# EAGLE design ADC128S022 and ADM823 Breakout Board (EAGLE 9.6.2)
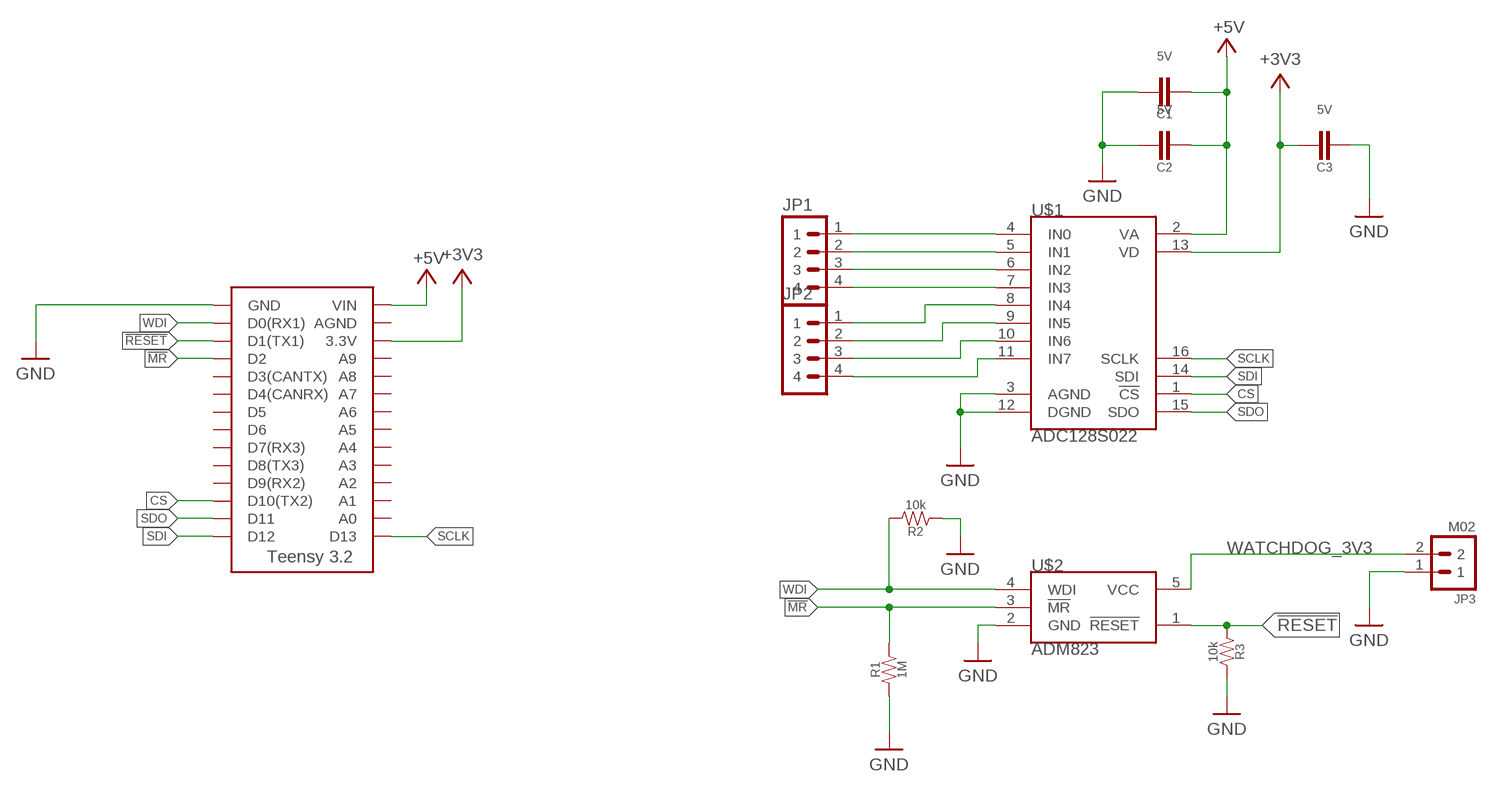
[diagram p0: schematic, sheet 1]

## Parts
C1  1uF  CAP0603-CAP  [0603-CAP]
C2  0.1uF  CAP0603-CAP  [0603-CAP]
C3  0.1uF  CAP0603-CAP  [0603-CAP]
JP1  M04  [1X04]
JP2  M04  [1X04]
JP3  M02  [1X02]
R1  1M  RESISTOR0603  [0603-RES]
R2  10k  RESISTOR0603  [0603-RES]
R3  10k  RESISTOR0603  [0603-RES]
U$1  ADC128S022  [TSSOP-16]
U$2  ADM823  [SOT323-5]
U$3  TEENSY_3.2_SIMPLE  [TEENSY_3.2_SIMPLE]

## Nets
!MR!: R1.2 U$2.3(!MR!) U$3.D2
!RESET!: R3.1 U$2.1(!RESET!) U$3.D1(TX1)
+3V3: C3.1 U$1.13(VD) U$3.3.3V
+5V: C1.2 C2.2 U$1.2(VA) U$3.VIN
CS: U$1.1(!CS!) U$3.D10(TX2)
GND: C1.1 C2.1 C3.2 JP3.1 R1.1 R2.1 R3.2 U$1.3(AGND) U$1.12(DGND) U$2.2(GND) U$3.GND
N$1: JP1.1 U$1.4(IN0)
N$2: JP1.2 U$1.5(IN1)
N$3: JP1.3 U$1.6(IN2)
N$4: JP1.4 U$1.7(IN3)
N$5: JP2.1 U$1.8(IN4)
N$6: JP2.2 U$1.9(IN5)
N$7: JP2.3 U$1.10(IN6)
N$8: JP2.4 U$1.11(IN7)
SCLK: U$1.16(SCLK) U$3.D13
SDI: U$1.14(SDI) U$3.D12
SDO: U$1.15(SDO) U$3.D11
WATCHDOG_3V3: JP3.2 U$2.5(VCC)
WDI: R2.2 U$2.4(WDI) U$3.D0(RX1)
Unconnected: U$3.A0 U$3.A1 U$3.A2 U$3.A3 U$3.A4 U$3.A5 U$3.A6 U$3.A7 U$3.A8 U$3.A9 U$3.AGND U$3.D3(CANTX) U$3.D4(CANRX) U$3.D5 U$3.D6 U$3.D7(RX3) U$3.D8(TX3) U$3.D9(RX2)

## Library data of the parts
C1-C3 = HyTechDevices:CAP: Capacitor Standard 0603 ceramic capacitor, and 0.1" leaded capacitor.; VALUE: 4; VOLTAGE: 5V
JP1 JP2 = HyTechDevices:M04: Standard 4-pin 0.1" header. NOTES ON THE VARIANTS LOCK and LOCK_LONGPADS... This footprint was designed to help hold the alignment of a through-hole component (i.e. 6-pin header) while soldering it into place. You may notice that each hole has been shifted either up or down by 0.005 of an inch from it's more standard position (which is a perfectly straight line). This slight alteration caused the pins (the squares in the middle) to touch the edges of the holes. Because they are alternating, it causes a "brace" to hold the component in place. 0.005 has proven to be the perfect amount of "off-center" position when using our standard breakaway headers. Although looks a little odd when you look at the bare footprint, once you have a header in there, the alteration is very hard to notice. Also,if you push a header all the way into place, it is covered up entirely on the bottom side. This idea of altering the position of holes to aid alignment will be further integrated into the Sparkfun Library for other footprints. It can help hold any component with 3 or more connection pins. Note: The Sparkfun version includes many other packages including surface mount that may be of future interest. Source: Sparkfun <https://github.com/sparkfun/SparkFun-Eagle-Libraries>
JP3 = HyTechDevices:M02: Standard 2-pin 0.1" header. NOTES ON THE VARIANTS LOCK and LOCK_LONGPADS... This footprint was designed to help hold the alignment of a through-hole component (i.e. 6-pin header) while soldering it into place. You may notice that each hole has been shifted either up or down by 0.005 of an inch from it's more standard position (which is a perfectly straight line). This slight alteration caused the pins (the squares in the middle) to touch the edges of the holes. Because they are alternating, it causes a "brace" to hold the component in place. 0.005 has proven to be the perfect amount of "off-center" position when using our standard breakaway headers. Although looks a little odd when you look at the bare footprint, once you have a header in there, the alteration is very hard to notice. Also,if you push a header all the way into place, it is covered up entirely on the bottom side. This idea of altering the position of holes to aid alignment will be further integrated into the Sparkfun Library for other footprints. It can help hold any component with 3 or more connection pins. Note: The Sparkfun version includes many other packages including surface mount that may be of future interest. Source: Sparkfun <https://github.com/sparkfun/SparkFun-Eagle-Libraries>
R1-R3 = HyTechDevices:RESISTOR: Resistor Basic schematic elements and footprints for 0603, 1206, and PTH resistors.
U$1 = HyTechDevices:ADC128S022: ADC128S022 8-channel Analog to Digital Converter Datasheet <https://www.ti.com/lit/ds/symlink/adc128s022.pdf?ts=1609290895378&ref_url=https%253A%252F%252Fwww.ti.com%252Fproduct%252FADC128S022%253Fqgpn%253Dadc128s022>
U$2 = HyTechDevices:ADM823: ADM823 Watchdog Timer Datasheet <https://www.analog.com/media/en/technical-documentation/data-sheets/ADM823_824_825.pdf>
U$3 = HyTechDevices:TEENSY_3.2_SIMPLE: Simple version of the Teensy 3.2 board that only uses the 2 main rows of pins, not the inner pins or the pins opposite the usb port.

## Board
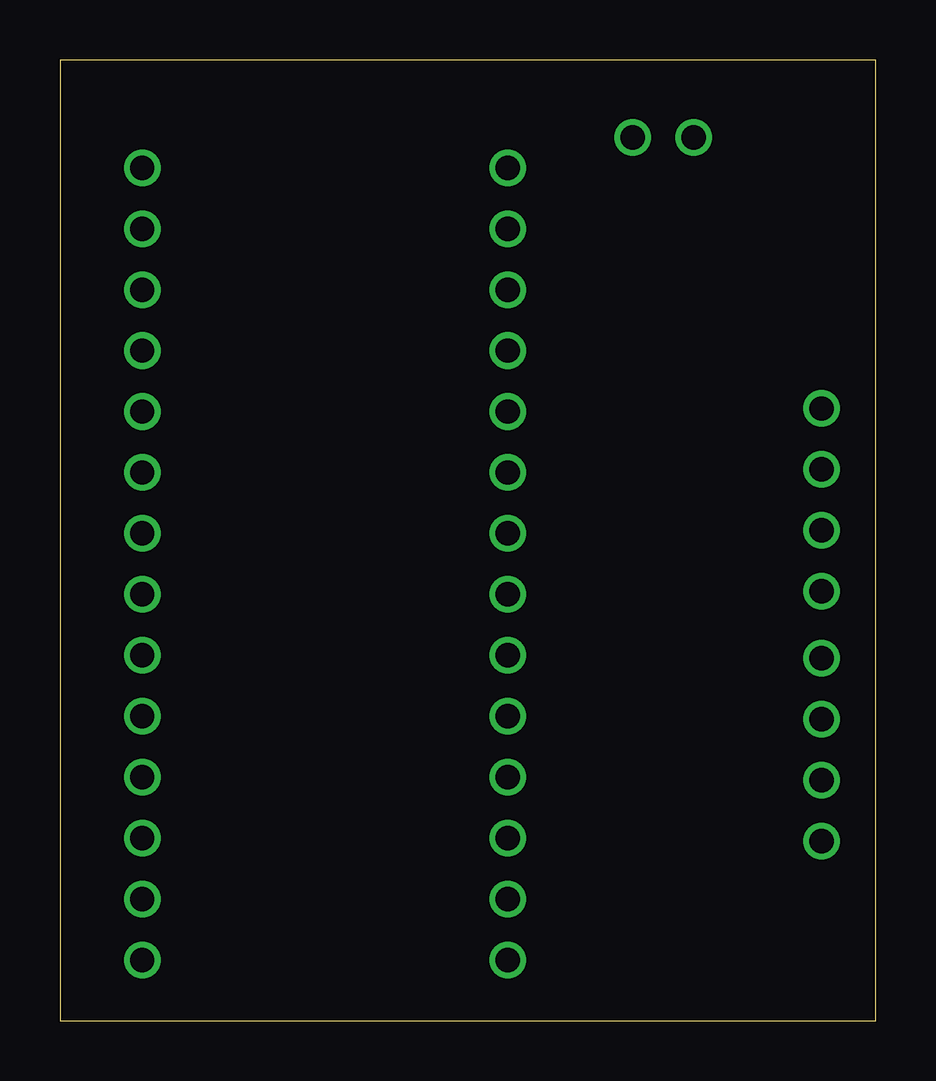
[diagram p1: board, top side]
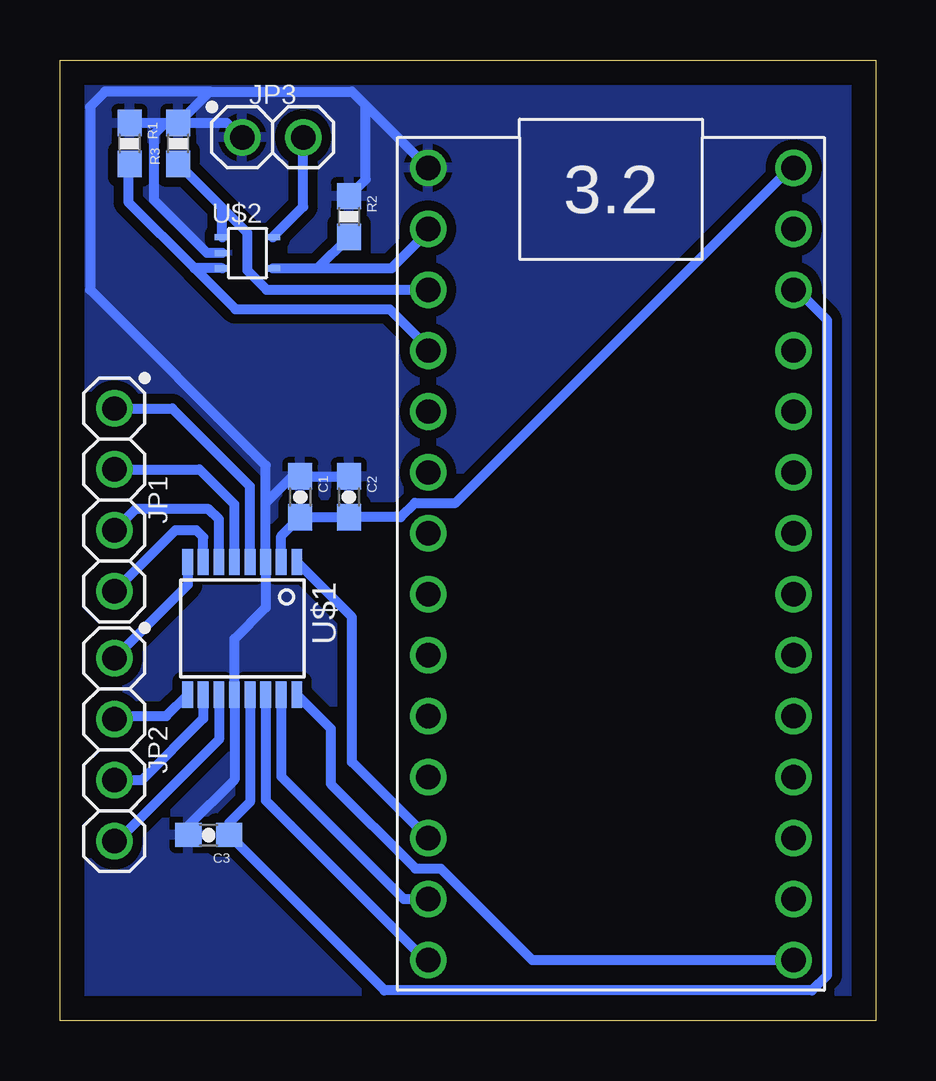
[diagram p2: board, bottom side, seen from below]

Size 34.02 x 40.06 mm. Coordinates in mm from the lower left corner, seen from the top.
Outline: 0,0 34.02,0 34.02,40.06 0,40.06 0,0
Copper layers 16: Bottom 0.035mm
Design rules "On Campus (1 Layer)": minimum track width 16mil, minimum drill 0.8mm, track to track 16mil, track to pad 12mil, pad to pad 16mil, via to via 16mil, smd to smd 10mil, copper to edge 40mil, drill to drill 10mil, minimum pad ring 10mil, minimum via ring 8mil, stop-mask expansion 4mil, vias tented up to drill 0mil, thermal gap 10mil

### Footprints (pad centres in the part's own frame; a part is rotated, then mirrored left to right if it is on the bottom)
0603-CAP = smd 1.1 x 1: 1 -0.85,0; 2 0.85,0
1X04 = drill 1.016: 1 -3.81,0; 2 -1.27,0; 3 1.27,0; 4 3.81,0
1X02 = drill 1.016: 1 -1.27,0; 2 1.27,0
0603-RES = smd 1.1 x 1: 1 -0.85,0; 2 0.85,0
TSSOP-16 = smd 0.45 x 1.1: 1 -2.275,-2.618; 2 -1.625,-2.618; 3 -0.975,-2.618; 4 -0.325,-2.618; 5 0.325,-2.618; 6 0.975,-2.618; 7 1.625,-2.618; 8 2.275,-2.618; 9 2.275,2.918; 10 1.625,2.918; 11 0.975,2.918; 12 0.325,2.918; 13 -0.325,2.918; 14 -0.975,2.918; 15 -1.625,2.918; 16 -2.275,2.918
SOT323-5 = smd 0.61 x 0.254: 1 -2.108,1.295; 2 -2.108,0.635; 3 -2.108,0; 4 0,0; 5 0,1.295
TEENSY_3.2_SIMPLE = drill 1.016: 3.3V 16.51,29.21; A0 16.51,3.81; A1 16.51,6.35; A2 16.51,8.89; A3 16.51,11.43; A4 16.51,13.97; A5 16.51,16.51; A6 16.51,19.05; A7 16.51,21.59; A8 16.51,24.13; A9 16.51,26.67; AGND 16.51,31.75; D0(RX1) 1.27,31.75; D1(TX1) 1.27,29.21; D2 1.27,26.67; D3(CANTX) 1.27,24.13; D4(CANRX) 1.27,21.59; D5 1.27,19.05; D6 1.27,16.51; D7(RX3) 1.27,13.97; D8(TX3) 1.27,11.43; D9(RX2) 1.27,8.89; D10(TX2) 1.27,6.35; D11 1.27,3.81; D12 1.27,1.27; D13 16.51,1.27; GND 1.27,34.29; VIN 16.51,34.29

### Placement (x,y rotation side)
C1  24,21.84 270 bottom
C2  21.97,21.84 270 bottom
C3  27.81,7.75 180 bottom
JP1  31.75,21.72 270 bottom
JP2  31.75,11.3 270 bottom
JP3  25.15,36.83 0 bottom
R1  31.12,36.58 270 bottom
R2  21.97,33.53 270 bottom
R3  29.08,36.58 90 bottom
U$1  26.42,16.51 180 bottom
U$2  25.15,31.37 0 bottom
U$3  19.94,1.27 0 bottom

### Tracks (layer width: path | path; a pad name or v marks a point on that pad's centre or on a via)
!MR!
  Bottom 0.406: R1.2 31.17,35.68 31.17,34.13 28.4,31.37 | 28.4,31.37 26.7,29.67 20.27,29.67 18.67,28.07 U$3.D2 | U$2.3 28.4,31.37
!RESET!
  Bottom 0.406: 27.25,33.9 26.21,32.86 26.21,31.29 25.41,30.48 U$3.D1(TX1) | R3.1 28.94,35.58 27.25,33.9 | U$2.1 27.25,33.9
+3V3
  Bottom 0.406: U$1.13 26.09,9.13 26.96,8.26 C3.1 20.49,1.27 2.67,1.27 2.03,1.91 2.03,29.21 3.3,30.48 U$3.3.3V
+5V
  Bottom 0.406: U$1.2 24.79,20.21 C1.2 C2.2 19.81,20.99 19.22,21.59 17.53,21.59 3.56,35.56 U$3.VIN
CS
  Bottom 0.406: U$1.1 21.84,16.83 21.84,10.79 U$3.D10(TX2)
GND
  Bottom 0.406: 27.77,38.73 32.13,38.73 32.77,38.1 32.77,30.48 25.44,23.15 25.44,21.59 | 25.44,21.59 U$1.3 25.44,17.23 26.74,15.93 U$1.12 26.74,10.05 28.66,8.13 C3.2 | C1.1 C2.1 | 30.82,37.43 R1.1 R3.2 | R3.2 27.77,38.73 | C1.1 24.17,22.69 | JP3.1 26.45,36.83 27.05,37.43 R3.2 | U$2.2 27.89,32 30.1,34.21 30.1,36.96 29.63,37.43 R3.2 | 27.77,38.73 21.84,38.73 21.27,38.16 | 21.27,38.16 U$3.GND | R2.1 21.27,35.08 21.27,38.16 | 25.44,21.59 24.34,22.69 C1.1
  pour Bottom: 0.13,40.13 0.13,0 34.29,0 34.29,40.13
N$1
  Bottom 0.406: U$1.4 26.09,22.28 29.34,25.53 JP1.1
N$2
  Bottom 0.406: U$1.5 26.74,21.53 28.19,22.99 JP1.2
N$3
  Bottom 0.406: U$1.6 27.39,20.91 27.81,21.34 30.86,21.34 JP1.3
N$4
  Bottom 0.406: U$1.7 28.04,20.17 28.32,20.45 29.21,20.45 JP1.4
N$5
  Bottom 0.406: JP2.1 28.69,18.17 U$1.8
N$6
  Bottom 0.406: U$1.9 29.58,12.7 31.62,12.7 JP2.2
N$7
  Bottom 0.406: U$1.10 28.04,12.6 30.61,10.03 JP2.3
N$8
  Bottom 0.406: U$1.11 27.39,11.73 31.62,7.49 JP2.4
SCLK
  Bottom 0.406: U$1.16 22.73,12.18 22.73,9.89 19.2,6.35 18.14,6.35 14.33,2.54 U$3.D13
SDI
  Bottom 0.406: U$1.14 25.44,9.18 18.8,2.54 U$3.D12
SDO
  Bottom 0.406: U$1.15 24.79,10.19 19.88,5.27 19.68,5.08 U$3.D11
WATCHDOG_3V3
  Bottom 0.406: U$2.5 23.88,33.93 JP3.2
WDI
  Bottom 0.406: U$2.4 23.28,31.37 | 23.28,31.37 R2.2 | 23.28,31.37 20.19,31.37 18.67,32.89 U$3.D0(RX1)